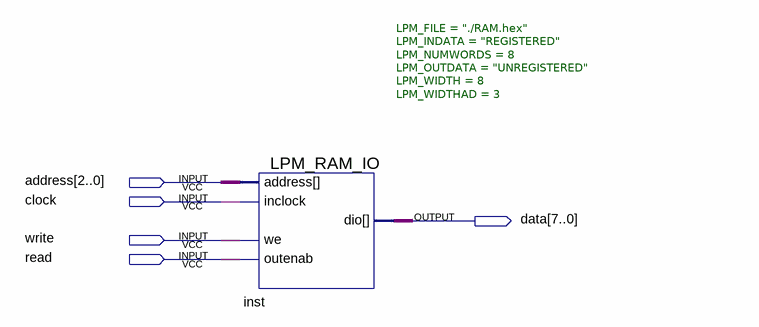
[diagram p0: schematic sheet]
// Quartus schematic RAM.bdf as structural Verilog: 1 symbols, 5 pins
module RAM (
  input  [2:0] address,
  input  clock,
  input  write,
  input  read,
  output [7:0] data
);

  LPM_RAM_IO #(.LPM_FILE("./RAM.hex"), .LPM_INDATA("REGISTERED"), .LPM_NUMWORDS(8), .LPM_OUTDATA("UNREGISTERED"), .LPM_WIDTH(8), .LPM_WIDTHAD(3)) inst (
    .address(address), .inclock(clock), .we(write), .outenab(read), .dio(data));
endmodule
